# EAGLE design satellites_pcb_th_v1 (EAGLE 7.6.0)
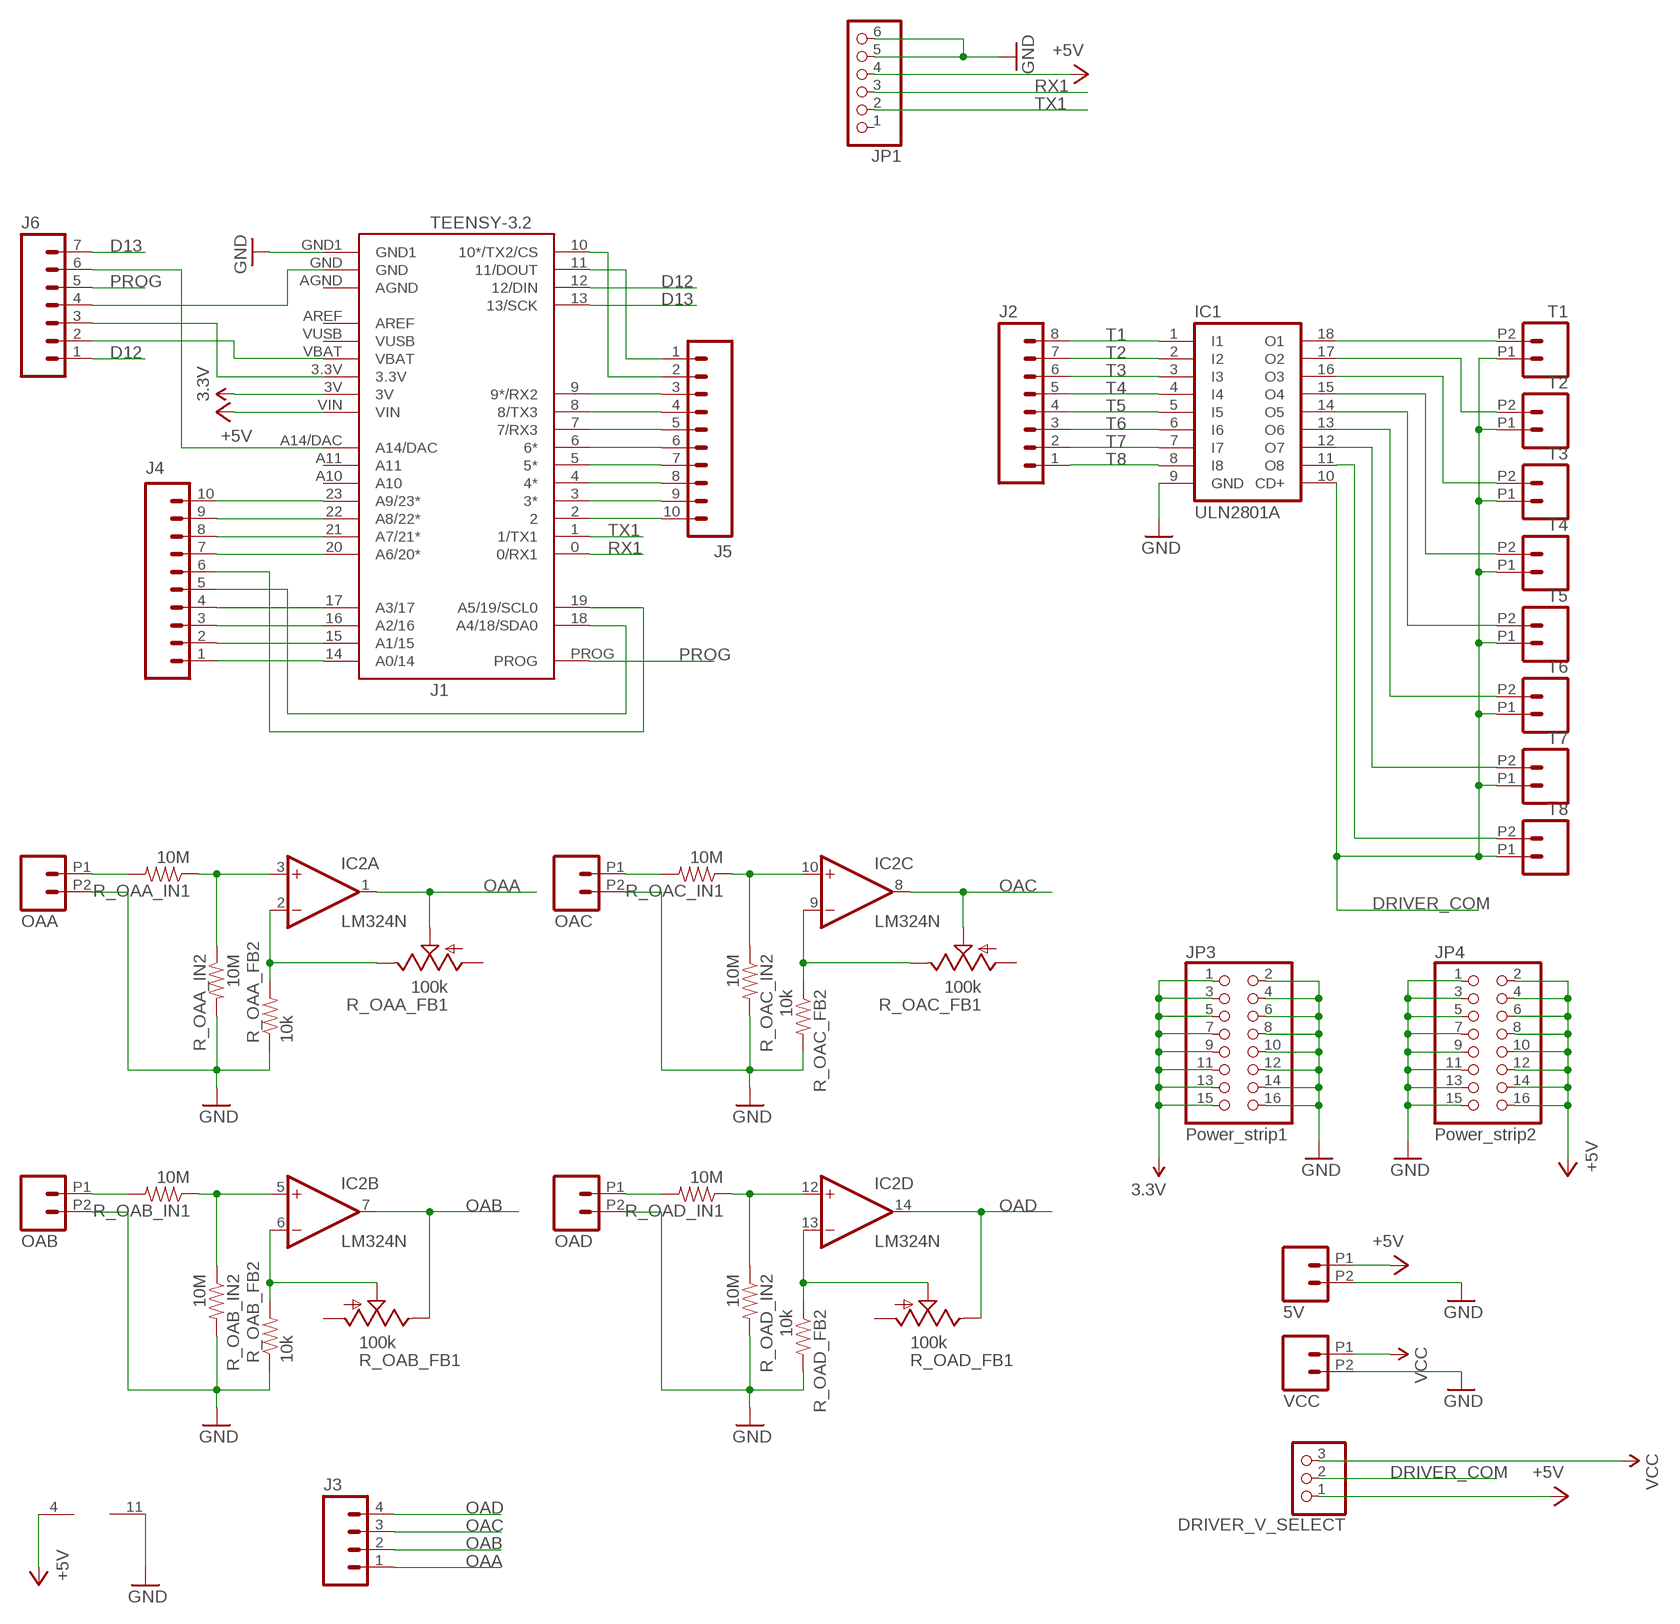
[diagram p0: schematic, sheet 1]

## Parts
5V  M022.54MM_SCREWTERM  [1X02_2.54_SCREWTERM]
DRIVER_V_SELECT  PINHD-1X3  [1X03]
IC1  ULN2801A  [DIL18]
IC2  LM324N  [DIL14]
J1  TEENSY-3.2  TEENSY-3.1NOSILK  [TEENSY-3.1_NOSILK]
J2  M08  [1X08_ROUND]
J3  M04PTH  [1X04]
J4  M10NO_SILK_PTH_FEMALE  [1X10_NO_SILK]
J5  M10NO_SILK_PTH_FEMALE  [1X10_NO_SILK]
J6  M07  [1X07]
JP1  PINHD-1X6  [1X06]
JP3  Power_strip1  PINHD-2X8  [2X08]
JP4  Power_strip2  PINHD-2X8  [2X08]
OAA  M022.54MM_SCREWTERM  [1X02_2.54_SCREWTERM]
OAB  M022.54MM_SCREWTERM  [1X02_2.54_SCREWTERM]
OAC  M022.54MM_SCREWTERM  [1X02_2.54_SCREWTERM]
OAD  M022.54MM_SCREWTERM  [1X02_2.54_SCREWTERM]
R_OAA_FB1  100k  TRIM_US-B64W  [B64W]
R_OAA_FB2  10k  RESISTORAXIAL-0.3  [AXIAL-0.3]
R_OAA_IN1  10M  RESISTORAXIAL-0.3  [AXIAL-0.3]
R_OAA_IN2  10M  RESISTORAXIAL-0.3  [AXIAL-0.3]
R_OAB_FB1  100k  TRIM_US-B64W  [B64W]
R_OAB_FB2  10k  RESISTORAXIAL-0.3  [AXIAL-0.3]
R_OAB_IN1  10M  RESISTORAXIAL-0.3  [AXIAL-0.3]
R_OAB_IN2  10M  RESISTORAXIAL-0.3  [AXIAL-0.3]
R_OAC_FB1  100k  TRIM_US-B64W  [B64W]
R_OAC_FB2  10k  RESISTORAXIAL-0.3  [AXIAL-0.3]
R_OAC_IN1  10M  RESISTORAXIAL-0.3  [AXIAL-0.3]
R_OAC_IN2  10M  RESISTORAXIAL-0.3  [AXIAL-0.3]
R_OAD_FB1  100k  TRIM_US-B64W  [B64W]
R_OAD_FB2  10k  RESISTORAXIAL-0.3  [AXIAL-0.3]
R_OAD_IN1  10M  RESISTORAXIAL-0.3  [AXIAL-0.3]
R_OAD_IN2  10M  RESISTORAXIAL-0.3  [AXIAL-0.3]
T1  M022.54MM_SCREWTERM  [1X02_2.54_SCREWTERM]
T2  M022.54MM_SCREWTERM  [1X02_2.54_SCREWTERM]
T3  M022.54MM_SCREWTERM  [1X02_2.54_SCREWTERM]
T4  M022.54MM_SCREWTERM  [1X02_2.54_SCREWTERM]
T5  M022.54MM_SCREWTERM  [1X02_2.54_SCREWTERM]
T6  M022.54MM_SCREWTERM  [1X02_2.54_SCREWTERM]
T7  M022.54MM_SCREWTERM  [1X02_2.54_SCREWTERM]
T8  M022.54MM_SCREWTERM  [1X02_2.54_SCREWTERM]
VCC  M022.54MM_SCREWTERM  [1X02_2.54_SCREWTERM]

## Nets
3.3V [supply]: J1.3V JP3.1 JP3.3 JP3.5 JP3.7 JP3.9 JP3.11 JP3.13 JP3.15
+5V [supply]: 5V.P1 DRIVER_V_SELECT.1 IC2.4(P:V+) J1.VIN JP1.4 JP4.2 JP4.4 JP4.6 JP4.8 JP4.10 JP4.12 JP4.14 JP4.16
D12: J1.12(12/DIN) J6.1
D13: J1.13(13/SCK) J6.7
DRIVER_COM [supply]: DRIVER_V_SELECT.2 IC1.10(CD+) T1.P1 T2.P1 T3.P1 T4.P1 T5.P1 T6.P1 T7.P1 T8.P1
GND [supply]: 5V.P2 IC1.9(GND) IC2.11(P:V-) J1.GND1 JP1.5 JP1.6 JP3.2 JP3.4 JP3.6 JP3.8 JP3.10 JP3.12 JP3.14 JP3.16 JP4.1 JP4.3 JP4.5 JP4.7 JP4.9 JP4.11 JP4.13 JP4.15 OAA.P2 OAB.P2 OAC.P2 OAD.P2 R_OAA_FB2.P$1 R_OAA_IN2.P$2 R_OAB_FB2.P$1 R_OAB_IN2.P$2 R_OAC_FB2.P$2 R_OAC_IN2.P$2 R_OAD_FB2.P$2 R_OAD_IN2.P$2 VCC.P2
N$1: J1.14(A0/14) J4.1
N$2: J1.23(A9/23*) J4.10
N$3: J1.9(9*/RX2) J5.3
N$4: J1.8(8/TX3) J5.4
N$5: J1.7(7/RX3) J5.5
N$6: J1.6(6*) J5.6
N$7: J1.5(5*) J5.7
N$8: J1.10(10*/TX2/CS) J5.2
N$9: OAB.P1 R_OAB_IN1.P$2
N$10: J1.22(A8/22*) J4.9
N$11: J1.21(A7/21*) J4.8
N$12: J1.20(A6/20*) J4.7
N$13: IC2.3(A:+IN) R_OAA_IN1.P$1 R_OAA_IN2.P$1
N$14: OAC.P1 R_OAC_IN1.P$2
N$15: IC2.10(C:+IN) R_OAC_IN1.P$1 R_OAC_IN2.P$1
N$16: OAD.P1 R_OAD_IN1.P$2
N$17: J1.17(A3/17) J4.4
N$18: J1.16(A2/16) J4.3
N$19: J1.15(A1/15) J4.2
N$20: J1.18(A4/18/SDA0) J4.5
N$21: J1.19(A5/19/SCL0) J4.6
N$22 [supply]: IC1.11(O8) T8.P2
N$23: J1.4(4*) J5.8
N$24: J1.3(3*) J5.9
N$25 [supply]: IC1.18(O1) T1.P2
N$26 [supply]: IC1.17(O2) T2.P2
N$27 [supply]: IC1.16(O3) T3.P2
N$28 [supply]: IC1.15(O4) T4.P2
N$29 [supply]: IC1.14(O5) T5.P2
N$30 [supply]: IC1.13(O6) T6.P2
N$31 [supply]: IC1.12(O7) T7.P2
N$32: J1.2 J5.10
N$33: J1.11(11/DOUT) J5.1
N$34: J1.VBAT J6.2
N$35: J1.A14/DAC J6.6
N$36: IC2.2(A:-IN) R_OAA_FB1.E R_OAA_FB2.P$2
N$38: IC2.6(B:-IN) R_OAB_FB1.S R_OAB_FB2.P$2
N$40: IC2.9(C:-IN) R_OAC_FB1.E R_OAC_FB2.P$1
N$41: J1.3.3V J6.3
N$42: IC2.13(D:-IN) R_OAD_FB1.S R_OAD_FB2.P$1
N$43: J1.GND J6.4
N$44: OAA.P1 R_OAA_IN1.P$2
N$45: IC2.5(B:+IN) R_OAB_IN1.P$1 R_OAB_IN2.P$1
N$49: IC2.12(D:+IN) R_OAD_IN1.P$1 R_OAD_IN2.P$1
OAA: IC2.1(A:OUT) J3.1 R_OAA_FB1.S
OAB: IC2.7(B:OUT) J3.2 R_OAB_FB1.E
OAC: IC2.8(C:OUT) J3.3 R_OAC_FB1.S
OAD: IC2.14(D:OUT) J3.4 R_OAD_FB1.E
PROG: J1.PROG J6.5
RX1: J1.0(0/RX1) JP1.3
T1: IC1.1(I1) J2.8
T2: IC1.2(I2) J2.7
T3: IC1.3(I3) J2.6
T4: IC1.4(I4) J2.5
T5: IC1.5(I5) J2.4
T6: IC1.6(I6) J2.3
T7: IC1.7(I7) J2.2
T8: IC1.8(I8) J2.1
TX1: J1.1(1/TX1) JP1.2
VCC [supply]: DRIVER_V_SELECT.3 VCC.P1
Unconnected: J1.A10 J1.A11 J1.AGND J1.AREF J1.VUSB JP1.1 R_OAA_FB1.A R_OAB_FB1.A R_OAC_FB1.A R_OAD_FB1.A

## Library data of the parts
5V OAA OAB OAC OAD T1-T8 VCC = SparkFun-Connectors:M02: Standard 2-pin 0.1" header. Use with - straight break away headers ( PRT-00116) - right angle break away headers (PRT-00553) - swiss pins (PRT-00743) - machine pins (PRT-00117) - female headers (PRT-00115) Molex polarized connector foot print use with: PRT-08233 with associated crimp pins and housings. 2.54_SCREWTERM for use with PRT-10571. 3.5mm Screw Terminal footprints for PRT-08084 5mm Screw Terminal footprints for use with PRT-08432
DRIVER_V_SELECT = pinhead:PINHD-1X3: PIN HEADER
IC1 = uln-udn:ULN2801A: DRIVER ARRAY
IC2 = linear:LM324: OP AMP
J1 = SparkFun-Boards:TEENSY-3.1; SF_ID: DEV-12646
J2 = SparkFun-Connectors:M08: Header 8 Standard 8-pin 0.1" header. Use with straight break away headers (SKU : PRT-00116), right angle break away headers (PRT-00553), swiss pins (PRT-00743), machine pins (PRT-00117), and female headers (PRT-00115).; PROD_ID: CONN-08437
J3 = SparkFun-Connectors:M04: Header 4 Standard 4-pin 0.1" header. Use with straight break away headers (SKU : PRT-00116), right angle break away headers (PRT-00553), swiss pins (PRT-00743), machine pins (PRT-00117), and female headers (PRT-00115). Molex polarized connector foot print use with SKU : PRT-08231 with associated crimp pins and housings. 1MM SMD Version SKU: PRT-10208; PROD_ID: CONN-09696
J4 J5 = SparkFun-Connectors:M10: Header 10 Standard 10-pin 0.1" header. Use with straight break away headers (SKU : PRT-00116), right angle break away headers (PRT-00553), swiss pins (PRT-00743), machine pins (PRT-00117), and female headers (PRT-00115).; PROD_ID: CONN-11563
J6 = SparkFun-Connectors:M07: Header 7 Standard 7-pin 0.1" header. Use with straight break away headers (SKU : PRT-00116), right angle break away headers (PRT-00553), swiss pins (PRT-00743), machine pins (PRT-00117), and female headers (PRT-00115). NOTES ON THE VARIANTS LOCK and LOCK_LONGPADS... This footprint was designed to help hold the alignment of a through-hole component (i.e. 7-pin header) while soldering it into place. You may notice that each hole has been shifted either up or down by 0.005 of an inch from it's more standard position (which is usually a perfectly straight line). This slight alteration caused the pins (the squares in the middle) to touch the edges of the holes. Because they are alternating, it causes a "brace" to hold the header in place. 0.005 has proven to be the perfect amount of "off-center" position when using our standard breakaway headers. Although looks a little odd when you look at the bare footprint, once you have a header in there, the alteration is very hard to notice. Also, if you push a header all the way into place, it is covered up entirely on the bottom side. This idea of altering the position of holes to aid alignment will be further integrated into the Sparkfun Library for other footprints. It can help hold any component with 3 or more connection pins.
JP1 = adafruit:PINHD-1X6: PIN HEADER
JP3 JP4 = pinhead:PINHD-2X8: PIN HEADER
R_OAA_FB1 R_OAB_FB1 R_OAC_FB1 R_OAD_FB1 = pot:TRIM_US-: POTENTIOMETER
R_OAA_FB2 R_OAA_IN1 R_OAA_IN2 R_OAB_FB2 R_OAB_IN1 R_OAB_IN2 R_OAC_FB2 R_OAC_IN1 R_OAC_IN2 R_OAD_FB2 R_OAD_IN1 R_OAD_IN2 = SparkFun-Resistors:RESISTOR: Resistor Basic schematic elements and footprints for 0603, 1206, and PTH resistors.

## Net classes
0 default: width 0.254 mm, clearance 0.254 mm
1 supply: width 0.508 mm, clearance 0.508 mm

## Board
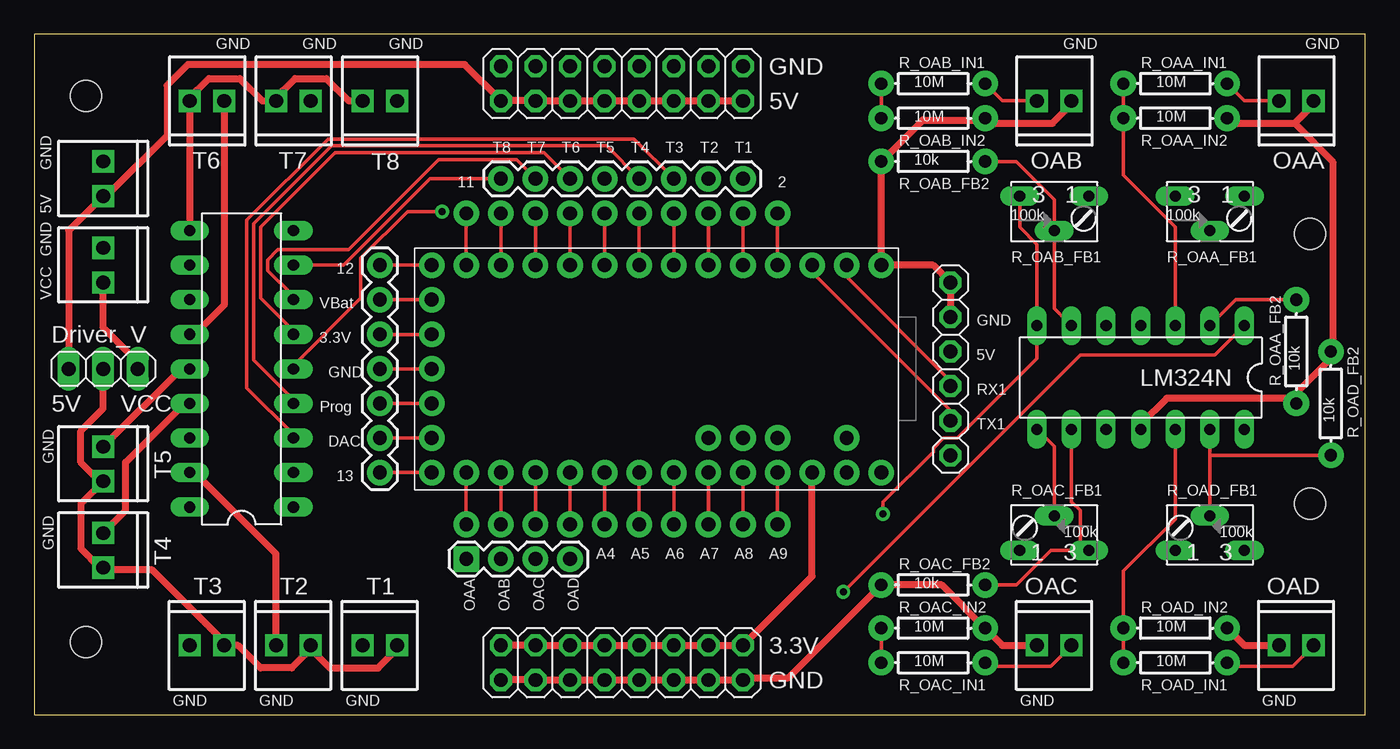
[diagram p1: board, top side]
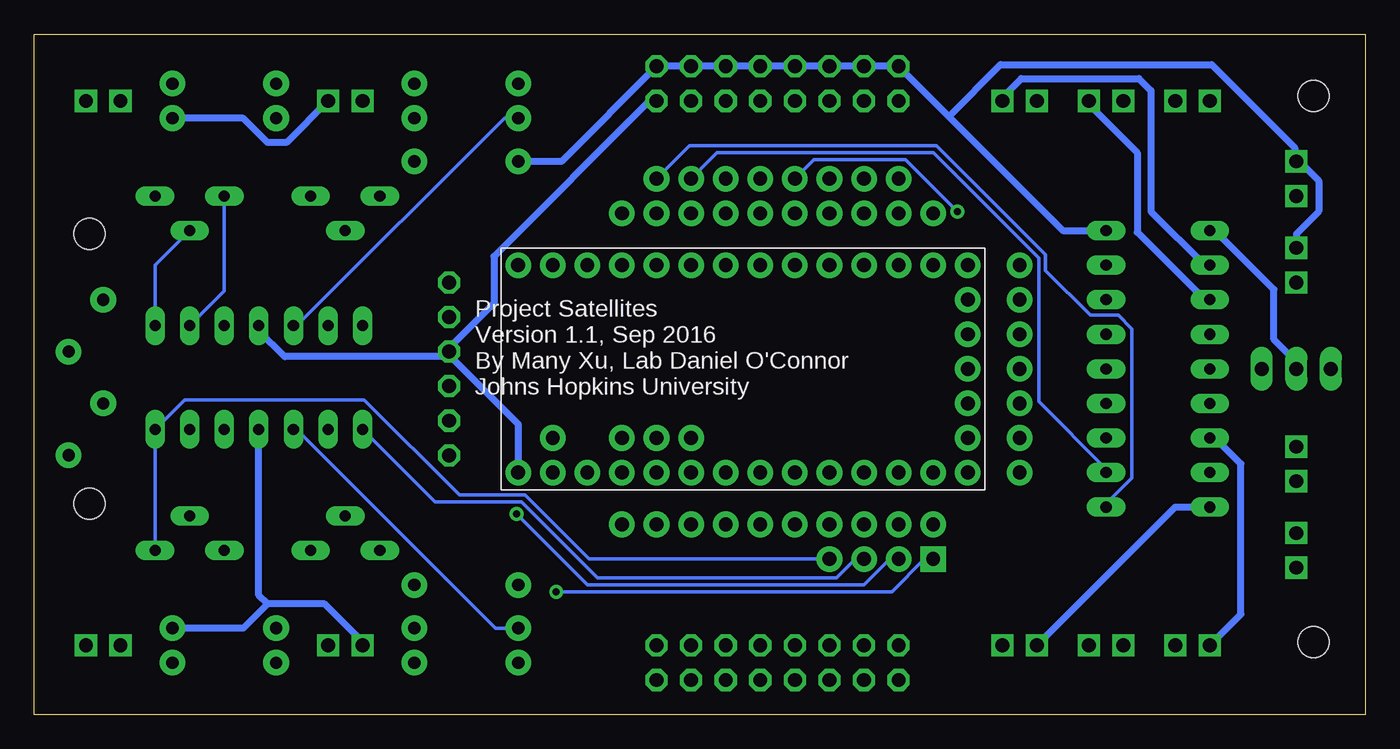
[diagram p2: board, bottom side, seen from below]

Size 97.79 x 50 mm. Coordinates in mm from the lower left corner, seen from the top.
Outline: 0,0 97.79,0 97.79,50 0,50 0,0
Copper layers (1*16): Top 0.035mm / dielectric 1.5mm / Bottom 0.035mm
Design rules "SparkFun": minimum track width 8mil, minimum drill 20mil, track to track 8mil, track to pad 8mil, pad to pad 8mil, via to via 8mil, smd to smd 8mil, copper to edge 10mil, drill to drill 8mil, minimum pad ring 12mil, minimum via ring 10mil, stop-mask expansion 4mil, vias tented up to drill 25mil, thermal gap 10mil
Holes 2.29 mm at 93.73,15.49 93.73,35.31 3.81,45.47 3.81,5.33

### Footprints (pad centres in the part's own frame; a part is rotated, then mirrored left to right if it is on the bottom)
1X02_2.54_SCREWTERM = drill 1.016 square: P1 2.54,0; P2 0,0
1X03 = drill 1.016 long: 1 -2.54,0; 2 0,0; 3 2.54,0
DIL18 = drill 0.813 long: 1 -10.16,-3.81; 2 -7.62,-3.81; 3 -5.08,-3.81; 4 -2.54,-3.81; 5 0,-3.81; 6 2.54,-3.81; 7 5.08,-3.81; 8 7.62,-3.81; 9 10.16,-3.81; 10 10.16,3.81; 11 7.62,3.81; 12 5.08,3.81; 13 2.54,3.81; 14 0,3.81; 15 -2.54,3.81; 16 -5.08,3.81; 17 -7.62,3.81; 18 -10.16,3.81
DIL14 = drill 0.813 long: 1 -7.62,-3.81; 2 -5.08,-3.81; 3 -2.54,-3.81; 4 0,-3.81; 5 2.54,-3.81; 6 5.08,-3.81; 7 7.62,-3.81; 8 7.62,3.81; 9 5.08,3.81; 10 2.54,3.81; 11 0,3.81; 12 -2.54,3.81; 13 -5.08,3.81; 14 -7.62,3.81
TEENSY-3.1_NOSILK = drill 1.016 pad 1.88: 0 16.51,3.81; 1 16.51,6.35; 2 16.51,8.89; 3 16.51,11.43; 3.3V 11.43,34.29; 3V 1.27,6.35; 4 16.51,13.97; 5 16.51,16.51; 6 16.51,19.05; 7 16.51,21.59; 8 16.51,24.13; 9 16.51,26.67; 10 16.51,29.21; 11 16.51,31.75; 12 16.51,34.29; 13 1.27,34.29; 14 1.27,31.75; 15 1.27,29.21; 16 1.27,26.67; 17 1.27,24.13; 18 1.27,21.59; 19 1.27,19.05; 20 1.27,16.51; 21 1.27,13.97; 22 1.27,11.43; 23 1.27,8.89; A10 3.81,11.43; A11 3.81,13.97; A14/DAC 3.81,34.29; AGND 1.27,3.81; AREF 3.81,8.89; GND 8.89,34.29; GND1 16.51,1.27; PROG 6.35,34.29; VBAT 13.97,34.29; VIN 1.27,1.27; VUSB 3.81,3.81
1X08_ROUND = drill 1.016 pad 1.88: 1 0,0; 2 2.54,0; 3 5.08,0; 4 7.62,0; 5 10.16,0; 6 12.7,0; 7 15.24,0; 8 17.78,0
1X04 = drill 1.016 pad 1.88 square: 1 0,0 | drill 1.016 pad 1.88: 2 2.54,0; 3 5.08,0; 4 7.62,0
1X10_NO_SILK = drill 1.016 pad 1.88: 1 0,0; 2 2.54,0; 3 5.08,0; 4 7.62,0; 5 10.16,0; 6 12.7,0; 7 15.24,0; 8 17.78,0; 9 20.32,0; 10 22.86,0
1X07 = drill 1.016 pad 1.88: 1 0,0; 2 2.54,0; 3 5.08,0; 4 7.62,0; 5 10.16,0; 6 12.7,0; 7 15.24,0
1X06 = drill 1.016 octagon: 1 -6.35,0; 2 -3.81,0; 3 -1.27,0; 4 1.27,0; 5 3.81,0; 6 6.35,0
2X08 = drill 1.016 octagon: 1 -8.89,-1.27; 2 -8.89,1.27; 3 -6.35,-1.27; 4 -6.35,1.27; 5 -3.81,-1.27; 6 -3.81,1.27; 7 -1.27,-1.27; 8 -1.27,1.27; 9 1.27,-1.27; 10 1.27,1.27; 11 3.81,-1.27; 12 3.81,1.27; 13 6.35,-1.27; 14 6.35,1.27; 15 8.89,-1.27; 16 8.89,1.27
B64W = drill 0.813 long: A 2.54,0; E -2.54,0; S 0,-2.54
AXIAL-0.3 = drill 0.9 pad 1.88: P$1 -3.81,0; P$2 3.81,0

### Placement (x,y rotation side)
5V  5.08,40.64 270 top
DRIVER_V_SELECT  5.08,25.4 0 top
IC1  15.24,25.4 90 top
IC2  81.28,24.77 180 top
J1  63.5,16.51 90 top
J2  34.29,39.37 0 top
J3  31.75,11.43 0 top
J4  31.75,13.97 0 top
J5  31.75,36.83 0 top
J6  25.4,33.02 270 top
JP1  67.31,25.4 90 top
JP3  43.18,3.81 180 top
JP4  43.18,46.35 180 top
OAA  93.98,45.09 180 top
OAB  76.2,45.09 180 top
OAC  73.66,5.08 0 top
OAD  91.44,5.08 0 top
R_OAA_FB1  86.36,38.1 0 top
R_OAA_FB2  92.71,26.67 90 top
R_OAA_IN1  83.82,46.35 0 top
R_OAA_IN2  83.82,43.81 0 top
R_OAB_FB1  74.93,38.1 0 top
R_OAB_FB2  66.04,40.64 0 top
R_OAB_IN1  66.04,46.35 0 top
R_OAB_IN2  66.04,43.81 0 top
R_OAC_FB1  74.93,12.06 180 top
R_OAC_FB2  66.04,9.53 180 top
R_OAC_IN1  66.04,3.81 0 top
R_OAC_IN2  66.04,6.35 0 top
R_OAD_FB1  86.36,12.06 180 top
R_OAD_FB2  95.25,22.86 90 top
R_OAD_IN1  83.82,3.81 0 top
R_OAD_IN2  83.82,6.35 0 top
T1  24.13,5.08 0 top
T2  17.78,5.08 0 top
T3  11.43,5.08 0 top
T4  5.08,13.34 270 top
T5  5.08,19.68 270 top
T6  13.97,45.09 180 top
T7  20.32,45.09 180 top
T8  26.67,45.09 180 top
VCC  5.08,34.29 270 top

### Tracks (layer width: path | path; a pad name or v marks a point on that pad's centre or on a via)
3.3V
  Top 0.508: JP3.15 JP3.13 JP3.11 JP3.9 JP3.7 JP3.5 JP3.3 JP3.1 57.15,10.16 J1.3V
+5V
  Top 0.508: DRIVER_V_SELECT.1 2.54,35.56 5V.P1 5.21,38.23 5.46,38.23 9.78,42.55 9.78,46.23 11.3,47.75 31.62,47.75 JP4.16 JP4.14 JP4.12 JP4.10 JP4.8 JP4.6 JP4.4 JP4.2
  Bottom 0.508: IC2.4 81.28,28.19 79.38,26.29 67.69,26.29 JP1.4 | J1.VIN 62.23,21.34 67.31,26.42 JP1.4 | JP4.2 52.58,45.09 64.01,33.66 64.01,30.23 67.18,27.05 67.18,26.8 JP1.4
D12
  Top 0.254: J1.12 J6.1
D13
  Top 0.254: J1.13 J6.7
DRIVER_COM
  Top 0.508: IC1.10 T6.P1 11.3,45.21 12.83,46.74 15.11,46.74 16.76,45.09 T7.P1 17.65,45.21 19.18,46.74 21.46,46.74 23.11,45.09 T8.P1 | T1.P1 26.67,4.83 25.27,3.43 21.72,3.43 20.45,4.7 T2.P1 20.32,4.83 18.92,3.43 16.64,3.43 14.99,5.08 T3.P1 13.84,5.21 13.84,5.46 8.64,10.67 5.21,10.67 T4.P1 4.83,10.79 3.43,12.19 3.43,15.49 T5.P1 4.83,17.14 3.43,18.54 3.43,20.83 5.08,22.48 DRIVER_V_SELECT.2
  Bottom 0.508: IC1.10 11.05,35.56 6.73,31.24 6.73,27.56 5.08,25.91 DRIVER_V_SELECT.2
GND
  Top 0.508: IC2.11 81.28,21.34 83.19,23.24 92.33,23.24 R_OAA_FB2.P$1 92.46,23.37 95.25,26.16 R_OAD_FB2.P$2 95.38,26.8 95.38,40.64 92.58,43.43 | JP3.16 JP3.14 JP3.12 JP3.10 JP3.8 JP3.6 JP3.4 JP3.2 52.2,2.67 55.37,2.67 R_OAC_FB2.P$2 66.67,9.53 R_OAC_IN2.P$2 71.12,5.08 OAC.P2 | OAD.P2 88.9,5.08 R_OAD_IN2.P$2 | OAA.P2 93.98,44.83 92.58,43.43 | 92.58,43.43 88.01,43.43 R_OAA_IN2.P$2 | OAB.P2 76.2,44.83 74.8,43.43 70.23,43.43 R_OAB_IN2.P$2 69.72,43.69 65.28,43.69 R_OAB_FB2.P$1 J1.GND1 66.04,33.02 JP1.6 JP1.5
  Bottom 0.508: R_OAD_IN2.P$2 82.42,6.35 80.64,8.13 | 80.64,8.13 76.45,8.13 73.66,5.33 OAC.P2 | IC2.11 81.28,8.76 80.64,8.13 | R_OAA_IN2.P$2 82.42,43.81 80.64,42.04 79.25,42.04 OAB.P2 | VCC.P2 5.08,35.31 3.43,36.96 3.43,39.24 4.83,40.64 5V.P2 5.21,40.77 5.21,41.66 11.3,47.75 26.8,47.75 30.61,43.94 | IC1.9 22.23,35.56 30.61,43.94 | 30.61,43.94 JP4.15 JP4.13 JP4.11 JP4.9 JP4.7 JP4.5 JP4.3 JP4.1 59.05,40.64 R_OAB_FB2.P$1
N$1
  Top 0.254: J1.14 J4.1
N$2
  Top 0.254: J1.23 J4.10
N$3
  Top 0.254: J5.3 J1.9
N$4
  Top 0.254: J5.4 J1.8
N$5
  Top 0.254: J5.5 J1.7
N$6
  Top 0.254: J5.6 J1.6
N$7
  Top 0.254: J5.7 J1.5
N$8
  Top 0.254: J5.2 J1.10
N$9
  Top 0.254: OAB.P1 71.12,45.09 R_OAB_IN1.P$2
N$10
  Top 0.254: J1.22 J4.9
N$11
  Top 0.254: J1.21 J4.8
N$12
  Top 0.254: J1.20 J4.7
N$13
  Top 0.254: IC2.3 83.82,35.81 80.01,39.62 R_OAA_IN2.P$1 R_OAA_IN1.P$1
N$14
  Top 0.254: OAC.P1 74.68,3.56 70.1,3.56 R_OAC_IN1.P$2
N$15
  Top 0.254: R_OAC_IN2.P$1 R_OAC_IN1.P$1
  Bottom 0.254: IC2.10 78.49,20.95 63.88,6.35 R_OAC_IN2.P$1
N$16
  Top 0.254: OAD.P1 92.46,3.56 87.88,3.56 R_OAD_IN1.P$2
N$17
  Top 0.254: J1.17 J4.4
N$18
  Top 0.254: J1.16 J4.3
N$19
  Top 0.254: J1.15 J4.2
N$20
  Top 0.254: J1.18 J4.5
N$21
  Top 0.254: J1.19 J4.6
N$22
  Bottom 0.508: IC1.11 11.81,33.02 15.75,36.96 15.75,45.85 16.64,46.74 25.27,46.74 26.67,45.34 T8.P2
N$23
  Top 0.254: J5.8 J1.4
N$24
  Top 0.254: J5.9 J1.3
N$25
  Bottom 0.508: IC1.18 13.97,15.24 T1.P2
N$26
  Top 0.508: IC1.17 11.81,17.78 17.78,11.81 T2.P2
N$27
  Bottom 0.508: IC1.16 11.05,20.32 9.14,18.41 9.14,7.37 T3.P2
N$28
  Top 0.508: IC1.15 11.05,22.86 6.73,18.54 6.73,14.99 T4.P2
N$29
  Top 0.508: IC1.14 10.79,25.4 T5.P2
N$30
  Top 0.508: IC1.13 11.81,27.94 13.97,30.1 T6.P2
N$31
  Bottom 0.508: IC1.12 11.81,30.48 16.76,35.43 16.76,41.27 20.32,44.83 T7.P2
N$32
  Top 0.254: J5.10 J1.2
N$33
  Top 0.254: J5.1 J1.11
N$34
  Top 0.254: J1.VBAT J6.2
N$35
  Top 0.254: J1.A14/DAC J6.6
N$36
  Top 0.254: R_OAA_FB2.P$2 88.27,30.48 IC2.2
  Bottom 0.254: R_OAA_FB1.E 83.82,31.11 IC2.2
N$38
  Top 0.254: IC2.6 74.93,29.84 R_OAB_FB1.S 74.93,37.85 72.14,40.64 R_OAB_FB2.P$2
N$40
  Top 0.254: 76.83,12.06 74.68,12.06 72.14,9.53 R_OAC_FB2.P$1 | IC2.9 76.2,15.62 76.83,14.99 76.83,12.06 | 76.83,12.06 R_OAC_FB1.E
N$41
  Top 0.254: J1.3.3V J6.3
N$42
  Top 0.254: IC2.13 86.36,19.05 | 86.36,19.05 R_OAD_FB1.S | 86.36,19.05 R_OAD_FB2.P$1
N$43
  Top 0.254: J1.GND J6.4
N$44
  Top 0.254: OAA.P1 88.9,45.09 R_OAA_IN1.P$2
N$45
  Top 0.254: R_OAB_IN2.P$1 R_OAB_IN1.P$1
  Bottom 0.254: IC2.5 78.49,28.57 63.25,43.81 R_OAB_IN2.P$1
N$49
  Top 0.254: IC2.12 83.82,14.35 80.01,10.54 R_OAD_IN2.P$1 R_OAD_IN1.P$1
OAA  (via drill 0.51)
  Top 0.254: v59.44,9.02 76.83,26.42 86.74,26.42 IC2.1
  Bottom 0.254: IC2.1 88.9,33.02 R_OAA_FB1.S | J3.1 32.38,11.43 34.8,9.02 v59.44,9.02
OAB  (via drill 0.51)
  Top 0.254: R_OAB_FB1.E 72.39,35.81 73.66,34.54 IC2.7 73.66,26.16 67.82,20.32 66.8,20.32 66.04,19.56 66.04,19.3 62.36,15.62 v62.36,14.73
  Bottom 0.254: J3.2 34.92,11.43 36.83,9.53 57.15,9.53 v62.36,14.73
OAC
  Top 0.254: R_OAC_FB1.S 74.93,19.68 IC2.8
  Bottom 0.254: J3.3 37.47,11.43 38.86,10.03 56.39,10.03 61.98,15.62 68.33,15.62 IC2.8
OAD
  Bottom 0.254: R_OAD_FB1.E IC2.14 86.74,23.11 73.53,23.11 66.55,16.13 61.72,16.13 57.02,11.43 J3.4
PROG
  Top 0.254: J1.PROG J6.5
RX1
  Top 0.254: JP1.3 67.31,24.51 59.69,32.13 J1.0
T1
  Bottom 0.254: IC1.1 19.05,15.49 17.14,17.4 17.14,28.32 18.16,29.34 20.19,29.34 23.5,32.64 23.5,33.78 31.5,41.78 49.66,41.78 J2.8
T2
  Bottom 0.254: IC1.2 19.05,18.03 24,22.99 24,33.53 31.75,41.27 47.62,41.27 J2.7
T3
  Top 0.254: IC1.3 19.05,20.57 15.62,24 15.62,36.32 21.59,42.29 44.07,42.29 J2.6
T4
  Top 0.254: IC1.4 19.05,23.11 16.13,26.04 16.13,36.07 21.84,41.78 42.04,41.78 J2.5
T5  (via drill 0.51)
  Top 0.254: IC1.5 19.05,25.65 24,30.61 24,33.53 27.43,36.96 v29.97,36.96
  Bottom 0.254: v29.97,36.96 33.78,40.77 40.51,40.77 J2.4
T6
  Top 0.254: IC1.6 19.05,28.19 16.64,30.61 16.64,35.81 22.1,41.27 37.47,41.27 J2.3
T7
  Top 0.254: IC1.7 19.05,30.73 17.14,32.64 17.14,33.4 17.91,34.16 23.11,34.16 29.72,40.77 35.43,40.77 J2.2
T8
  Top 0.254: IC1.8 22.73,33.02 29.08,39.37 J2.1
TX1
  Top 0.254: JP1.2 67.31,22.35 57.15,32.51 J1.1
VCC
  Top 0.508: VCC.P1 5.08,28.45 7.62,25.91 DRIVER_V_SELECT.3

### Text on the board
tPlace: GND | GND | GND | GND | GND | GND | 5V | T8 | T7 | T6 | T5 | T4 | T3 | T2 | T1 | GND | T8 | 11 | 2 | 5V | GND | 12 | VCC | VBat | GND | Driver_V | 3.3V | 5V | GND | RX1 | 5V | VCC | Prog | GND | TX1 | DAC | 13 | GND | A4 | A5 | A6 | A7 | A8 | A9 | OAA | OAB | OAC | OAD | 3.3V | GND | GND | GND | GND | GND | GND
bPlace: Project Satellites / Version 1.1, Sep 2016 / By Many Xu, Lab Daniel O'Connor / Johns Hopkins University